# Altium schematic sheet PX4FMUv2.4.6_07.SchDoc: PX4FMUv2.4.6.sch
size 282 x 200 mm; Date: 2015/3/26 21:06:20; SheetNumber: Sheet:
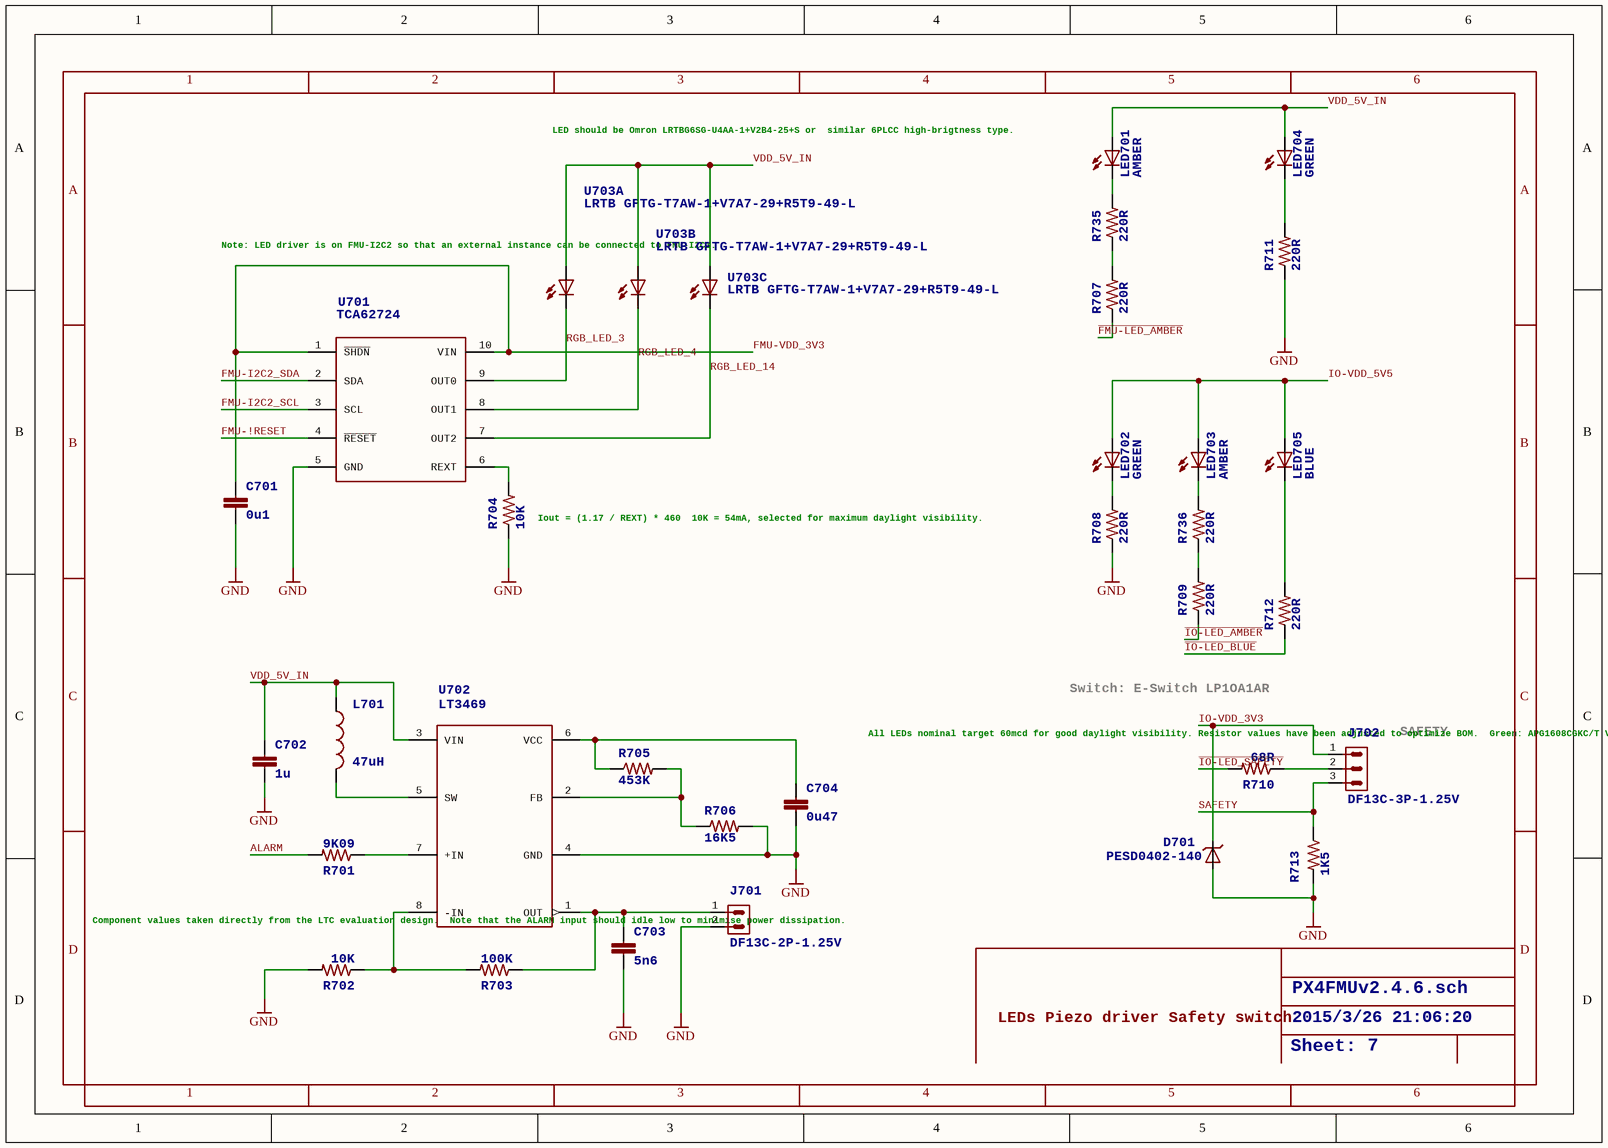
[diagram p0: PX4FMUv2.4.6_07.SchDoc]

## Parts
C701  0u1  [0402-CAP]
C702  1u  [0603-CAP]
C703  5n6  [0402-CAP]
C704  0u47  [0402-CAP]
D701  PESD0402-140  [0402-TVS]
J701  DF13C-2P-1.25V  [DF13C-2P-1.25V]
J702  DF13C-3P-1.25V  [DF13C-3P-1.25V]
L701  47uH  [0805-IND]
LED701  AMBER  [0603-LED]
LED702  GREEN  [0603-LED]
LED703  AMBER  [0603-LED]
LED704  GREEN  [0603-LED]
LED705  BLUE  [0603-LED]
R701  9K09  [0402-RES]
R702  10K  [0402-RES]
R703  100K  [0402-RES]
R704  10K  [0402-RES]
R705  453K  [0402-RES]
R706  16K5  [0402-RES]
R707  220R  [0402-RES]
R708  220R  [0402-RES]
R709  220R  [0402-RES]
R710  68R  [0402-RES]
R711  220R  [0402-RES]
R712  220R  [0402-RES]
R713  1K5  [0402-RES]
R735  220R  [0402-RES]
R736  220R  [0402-RES]
U701  TCA62724FMG  [SON10]  (value not drawn)
U702  LT3469  [SOT23-8]
U703  LRTB GFTG-T7AW-1+V7A7-29+R5T9-49-L  [6-PLCC]  (parts A,B,C of 3)

## Nets
GND: C701.P$2 C702.P$2 C703.P$2 C704.P$2 D701.A J701.2 R702.P$2 R704.P$1 R706.P$2 R708.P$1 R711.P$1 R713.P$2 U701.5(GND) U702.4(GND)
ALARM: R701.P$2
~{FMU-LED_AMBER}: R707.P$1
FMU-!RESET: U701.4(~{RESET})
FMU-I2C2_SCL: U701.3(SCL)
FMU-I2C2_SDA: U701.2(SDA)
FMU-VDD_3V3: C701.P$1 U701.1(~{SHDN}) U701.10(VIN)
~{IO-LED_AMBER}: R709.P$1
~{IO-LED_BLUE}: R712.P$1
~{IO-LED_SAFETY}: R710.P$2
IO-VDD_3V3: D701.C J702.1
IO-VDD_5V5: LED702.A LED703.A LED705.A
RGB_LED_3: U701.9(OUT0) U703.C1(C)
RGB_LED_4: U701.8(OUT1) U703.C2(C)
RGB_LED_14: U701.7(OUT2) U703.C3(C)
SAFETY: J702.3 R713.P$1
VDD_5V_IN: C702.P$1 L701.P$1 LED701.A LED704.A U702.3(VIN) U703.A1(A) U703.A2(A) U703.A3(A)
NetC703_P$1: C703.P$1 J701.1 R703.P$1 U702.1(OUT)
NetC704_P$1: C704.P$1 R705.P$1 U702.6(VCC)
NetJ702_2: J702.2 R710.P$1
NetL701_P$2: L701.P$2 U702.5(SW)
NetLED701_C: LED701.C R735.P$2
NetLED702_C: LED702.C R708.P$2
NetLED703_C: LED703.C R736.P$2
NetLED704_C: LED704.C R711.P$2
NetLED705_C: LED705.C R712.P$2
NetR701_P$1: R701.P$1 U702.7(+IN)
NetR702_P$1: R702.P$1 R703.P$2 U702.8(-IN)
NetR704_P$2: R704.P$2 U701.6(REXT)
NetR705_P$2: R705.P$2 R706.P$1 U702.2(FB)
NetR707_P$2: R707.P$2 R735.P$1
NetR709_P$2: R709.P$2 R736.P$1

## Notes on the sheet
- LED should be Omron LRTBG6SG-U4AA-1+V2B4-25+S or
  similar 6PLCC high-brigtness type.
- (near U703) Note: LED driver is on FMU-I2C2 so
  that an external instance can be
  connected to FMU-I2C1.
- (near R704) Iout = (1.17 / REXT) * 460
  10K = 54mA, selected for maximum
  daylight visibility.
- (near J702) All LEDs nominal target 60mcd
  for good daylight visibility.
  Resistor values have been adjusted
  to optimize BOM.
  Green: APG1608CGKC/T
  Vf(typ): 2.1V
  Target If: 20mA
  Selected R: 220
  Cacluated If @ 5.5V: 15mA
  Amber: APT1608SECK
  Vf(typ): 2.1V
  Target If: 5mA
  Selected R: 440
  Cacluated If @ 5.5V: 8mA
  Blue: APT1608QBC/G
  Vf(typ): 3.3V
  Target If: 6.6mA
  Selected R: 220
  Cacluated If @ 5.5V: 10mA
- Switch: E-Switch LP1OA1AR
- SAFETY
- (near U702) Component values taken directly from
  the LTC evaluation design.
  Note that the ALARM input should idle
  low to minimise power dissipation.
- LEDs
  Piezo driver
  Safety switch
- 1
- 2
- 3
- 4
- 5
- 6
- A
- B
- C
- D

## Library data of the parts
C701 = CAP0402: <b>Capacitor</b> / Standard 0603 ceramic capacitor, and 0.1" leaded capacitor.; PARTNO: CC0402ZRY5V7BB104
C702 = CAP0603: <b>Capacitor</b> / Standard 0603 ceramic capacitor, and 0.1" leaded capacitor.; PARTNO: CC0603ZRY5V7BB105
C703 = CAP0402: <b>Capacitor</b> / Standard 0603 ceramic capacitor, and 0.1" leaded capacitor.; PARTNO: C0402C562K5RACTU
C704 = CAP0402: <b>Capacitor</b> / Standard 0603 ceramic capacitor, and 0.1" leaded capacitor.; PARTNO: C1005X5R1C474K050BC
D701 = DIODE-TVS
J701 = DF13-2P-1.25V: DF13-2P / 1.25mm Pitch Miniature Crimping Connector.; PARTNO: DF13C-2P-1.25V(20)
J702 = DF13-3P-1.25V: DF13-3P / 1.25mm Pitch Miniature Crimping Connector.; PARTNO: DF13C-3P-1.25V(20)
L701 = INDUCTOR0805: <b>Inductors</b> / Basic Inductor/Choke - 0603 and 1210. Footprints are not proven and vary greatly between part numbers. / SRR1210: Bourns SRR1210 parts, e.g. SRR1210-100M; PARTNO: MLZ2012M470W
LED701 LED703 = LED0603: <b>LEDs</b> / Standard schematic elements and footprints for 5mm, 3mm, 1206, and 0603 sized LEDs. 5mm - Spark Fun Electronics SKU : COM-00529 (and others); PARTNO: APTD1608SECK
LED702 LED704 = LED0603: <b>LEDs</b> / Standard schematic elements and footprints for 5mm, 3mm, 1206, and 0603 sized LEDs. 5mm - Spark Fun Electronics SKU : COM-00529 (and others); PARTNO: APTD1608CGCK
LED705 = LED0603: <b>LEDs</b> / Standard schematic elements and footprints for 5mm, 3mm, 1206, and 0603 sized LEDs. 5mm - Spark Fun Electronics SKU : COM-00529 (and others); PARTNO: APTD1608QBC/D
R701 = RESISTOR0402-RES: <b>Resistor</b> / Basic schematic elements and footprints for 0603, 1206, and PTH 1/10th watt (small) resistors.; PARTNO: RMCF0402FT9K09
R702 R704 = RESISTOR0402-RES: <b>Resistor</b> / Basic schematic elements and footprints for 0603, 1206, and PTH 1/10th watt (small) resistors.; PARTNO: RC0402FR-0710KL
R703 = RESISTOR0402-RES: <b>Resistor</b> / Basic schematic elements and footprints for 0603, 1206, and PTH 1/10th watt (small) resistors.; PARTNO: RC0402FR-07100KL
R705 = RESISTOR0402-RES: <b>Resistor</b> / Basic schematic elements and footprints for 0603, 1206, and PTH 1/10th watt (small) resistors.; PARTNO: RMCF0402FT453K
R706 = RESISTOR0402-RES: <b>Resistor</b> / Basic schematic elements and footprints for 0603, 1206, and PTH 1/10th watt (small) resistors.; PARTNO: RMCF0402FT16K5
R707-R709 R711 R712 R735 R736 = RESISTOR0402-RES: <b>Resistor</b> / Basic schematic elements and footprints for 0603, 1206, and PTH 1/10th watt (small) resistors.; PARTNO: RC0402FR-07220RL
R710 = RESISTOR0402-RES: <b>Resistor</b> / Basic schematic elements and footprints for 0603, 1206, and PTH 1/10th watt (small) resistors.; PARTNO: ERJ-2GEJ680X
R713 = RESISTOR0402-RES: <b>Resistor</b> / Basic schematic elements and footprints for 0603, 1206, and PTH 1/10th watt (small) resistors.
U701 = TCA62724FMG: Toshiba TCA62724FMG I2C RGB LED driver; PARTNO: TCA62724FMG; TCA62724: TCA62724
U702 = LT3469: LT3469 Piezo microactuator driver with boost regulator; PARTNO: LT3469ETS8
U703 = RGB-LED6-PLCC: RGB LED with separate anode/cathode terminals; PARTNO: LRTB GFTG-T7AW-1+V7A7-29+R5T9-49-L